# Altium project PCB_Project.PrjPcb
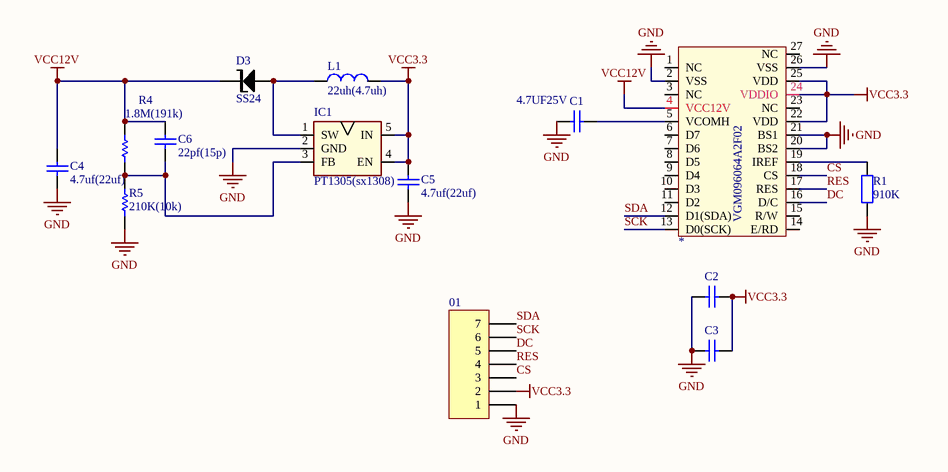
[diagram p0: Sheet1.SchDoc]
1 sheet, 14 parts. Net scope: global (net labels, ports and power ports of the same name join across sheets).
Board file: PCB1B.PcbDoc

## Sheet Sheet1.SchDoc
size A4

### Parts
01  Header 7  [HDR1X7]  (value not drawn)
*  VGM096064A2F02  [VGM096064A2F02]  (value not drawn)
C1  value 4.7UF25V  [LC-0805_C]  (hidden comment: Cap)
C2  Cap  [LC-0805_C]  (value not drawn)
C3  Cap  [LC-0805_C]  (value not drawn)
C4  value 4.7uf(22uf)  [LC-0805_C]  (hidden comment: Cap)
C5  value 4.7uf(22uf)  [LC-0805_C]  (hidden comment: Cap)
C6  value 22pf(15p)  [LC-0805_C]  (hidden comment: Cap)
D3  SS24  [LC-0805]
IC1  PT1305(sx1308)  [LC-SOT-23-5]
L1  22uh(4.7uh)  [CD31]
R1  value 910K  [LC-0805_R]  (hidden comment: Res2)
R4  value 1.8M(191k)  [LC-0805_R]  (hidden comment: Res1)
R5  value 210K(10k)  [LC-0805_R]  (hidden comment: Res1)

### Nets
GND: 01.1 *.2(VSS) *.20(BS2) *.21(BS1) *.26(VSS) C1.1 C2.1 C3.1 C4.1 C5.1 IC1.2(GND) R1.1 R5.1
VCC3.3: 01.2 *.22(VDD) *.24(VDDIO) *.25(VDD) C2.2 C3.2 C5.2 IC1.4(EN) IC1.5(IN) L1.1
VCC12V: *.4(VCC12V) C4.2 C6.2 D3.2(K) R4.2
CS: 01.3 *.18(CS)
DC: 01.5 *.16(D/C)
RES: 01.4 *.17(RES)
SCK: 01.6 *.13(D0(SCK))
SDA: 01.7 *.12(D1(SDA))
Net*_5: *.5(VCOMH) C1.2
Net*_19: *.19(IREF) R1.2
NetC6_1: C6.1 IC1.3(FB) R4.1 R5.2
NetD3_1: D3.1(A) IC1.1(SW) L1.2

Not connected (* = marked no-connect by the designer): * 1(NC) 3(NC) 6(D7) 7(D6) 8(D5) 9(D4) 10(D3) 11(D2) 14(E/RD) 15(R/W) 23(NC) 27(NC)

### Library data of the parts
01 = Header 7: Header, 7-Pin; LatestRevisionDate: 17-Jul-2002; LatestRevisionNote: Re-released for DXP Platform.; Publisher: Altium Limited
C1 C4-C6 = Cap: Capacitor; Published: 8-Jun-2000; LatestRevisionDate: 17-Jul-2002; LatestRevisionNote: Re-released for DXP Platform.; PackageReference: RAD-0.3; Publisher: Altium Limited; PackageDescription: Radial Cap, Thru-Hole; 2 Leads; 0.3 in Pin Spacing
C2 = Cap: Capacitor; Value: 0.1UF25V; Published: 8-Jun-2000; LatestRevisionDate: 17-Jul-2002; LatestRevisionNote: Re-released for DXP Platform.; PackageReference: RAD-0.3; Publisher: Altium Limited; PackageDescription: Radial Cap, Thru-Hole; 2 Leads; 0.3 in Pin Spacing
C3 = Cap: Capacitor; Value: 10UF25V; Published: 8-Jun-2000; LatestRevisionDate: 17-Jul-2002; LatestRevisionNote: Re-released for DXP Platform.; PackageReference: RAD-0.3; Publisher: Altium Limited; PackageDescription: Radial Cap, Thru-Hole; 2 Leads; 0.3 in Pin Spacing
D3 = SS24: 肖特基二极管; 版权归属: 源创客; 属性: 40V/2A; BOM名称: 肖特基二极管; 学习资源: www.ooocke.com
IC1 = PT1305
L1 = Inductor
R1 = Res2: Resistor; Published: 8-Jun-2000; LatestRevisionDate: 17-Jul-2002; LatestRevisionNote: Re-released for DXP Platform.; PackageReference: AXIAL-0.4; Publisher: Altium Limited; PackageDescription: Axial Device, Thru-Hole; 2 Leads; 0.4 in Pin Spacing
R4 R5 = Res1: Resistor; Published: 8-Jun-2000; LatestRevisionDate: 17-Jul-2002; LatestRevisionNote: Re-released for DXP Platform.; PackageReference: AXIAL-0.3; Publisher: Altium Limited; PackageDescription: Axial Device, Thru-Hole; 2 Leads; 0.3 in Pin Spacing